# EAGLE design 74122hack (EAGLE 6.6.0)
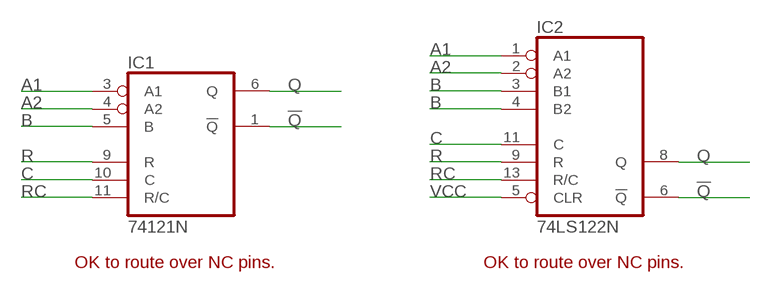
[diagram p0: schematic, sheet 1]

## Parts
IC1  74121N  [DIL14]
IC2  74LS122N  [DIL14]

## Nets
!Q: IC1.1(!Q) IC2.6(!Q)
A1: IC1.3(A1) IC2.1(A1)
A2: IC1.4(A2) IC2.2(A2)
B: IC1.5(B) IC2.3(B1) IC2.4(B2)
C: IC1.10(C) IC2.11(C)
Q: IC1.6(Q) IC2.8(Q)
R: IC1.9(R) IC2.9(R)
RC: IC1.11(R/C) IC2.13(R/C)
VCC: IC2.5(CLR)

## Notes on the sheet
- OK to route over NC pins. | OK to route over NC pins.

## Power pins joined to a net without a drawn wire
GND: IC1.7(GND) IC2.7(GND)
VCC: IC1.14(VCC) IC2.14(VCC)

## Library data of the parts
IC1 = 74xx-us:74*121: Monostable MULTIVIBRATOR, schmitt trigger inputs
IC2 = 74xx-us:74*122: Retriggerable monostable MULTIVIBRATOR

## Board
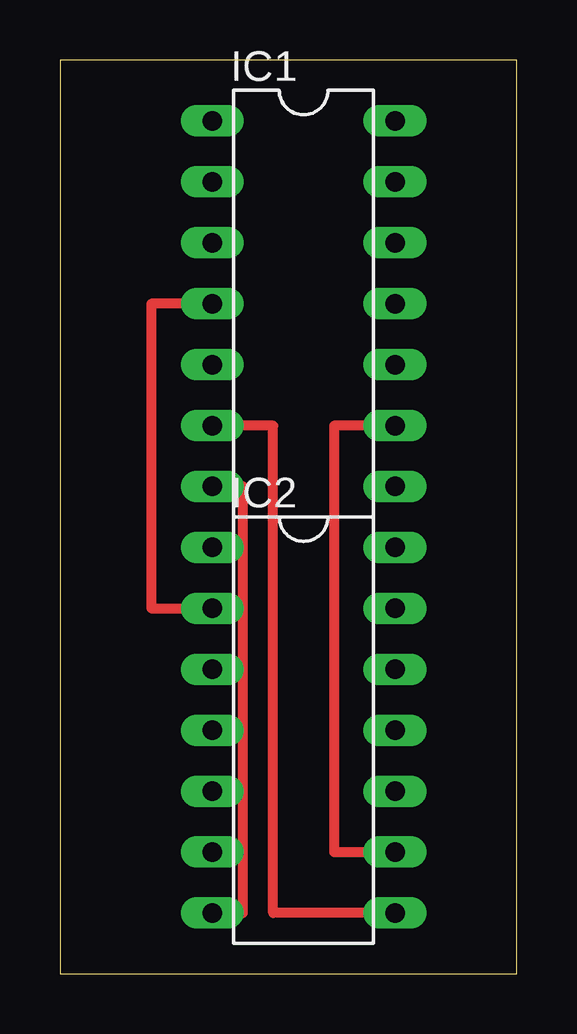
[diagram p1: board, top side]
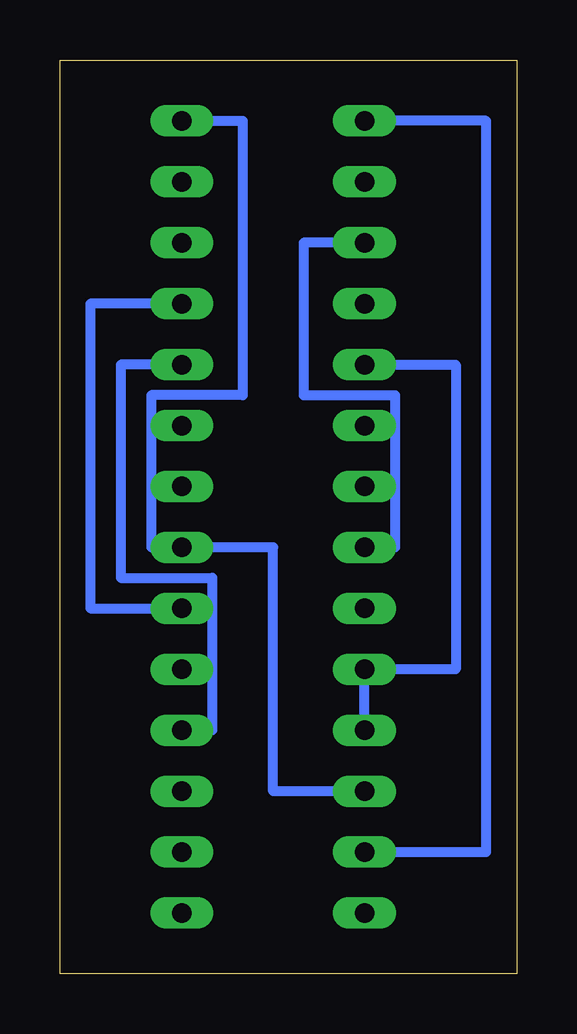
[diagram p2: board, bottom side, seen from below]

Size 19.05 x 38.1 mm. Coordinates in mm from the lower left corner, seen from the top.
Outline: 0,0 19.05,0 19.05,38.1 0,38.1 0,0
Copper layers (1+16): Top 0.035mm / dielectric 1.5mm / Bottom 0.035mm
Design rules "16mils": minimum track width 16mil, minimum drill 32mil, track to track 15mil, track to pad 10mil, pad to pad 10mil, via to via 10mil, smd to smd 10mil, copper to edge 13mil, drill to drill 10mil, minimum pad ring 10mil, minimum via ring 8mil, stop-mask expansion 0mil, vias tented up to drill 0mil, thermal gap 10mil

### Footprints (pad centres in the part's own frame; a part is rotated, then mirrored left to right if it is on the bottom)
DIL14 = drill 0.813 long: 1 -7.62,-3.81; 2 -5.08,-3.81; 3 -2.54,-3.81; 4 0,-3.81; 5 2.54,-3.81; 6 5.08,-3.81; 7 7.62,-3.81; 8 7.62,3.81; 9 5.08,3.81; 10 2.54,3.81; 11 0,3.81; 12 -2.54,3.81; 13 -5.08,3.81; 14 -7.62,3.81

### Placement (x,y rotation side)
IC1  10.16,27.94 270 top
IC2  10.16,10.16 270 top

### Tracks (layer width: path | path; a pad name or v marks a point on that pad's centre or on a via)
!Q
  Bottom 0.406: IC2.6 1.27,5.08 1.27,35.56 IC1.1
A1
  Bottom 0.406: IC1.3 8.89,30.48 8.89,24.13 5.08,24.13 5.08,17.78 IC2.1
A2
  Top 0.406: IC1.4 3.81,27.94 3.81,15.24 IC2.2
B
  Bottom 0.406: IC1.5 2.54,25.4 2.54,12.7 IC2.3 IC2.4
C
  Bottom 0.406: IC1.10 16.51,25.4 16.51,16.51 12.7,16.51 12.7,10.16 IC2.11
GND
  Top 0.406: IC1.7 7.62,20.32 7.62,2.54 IC2.7
Q
  Top 0.406: IC2.8 8.89,2.54 8.89,22.86 IC1.6
R
  Top 0.406: IC1.9 11.43,22.86 11.43,5.08 IC2.9
RC
  Bottom 0.406: IC1.11 17.78,27.94 17.78,15.24 IC2.13
VCC
  Bottom 0.406: IC2.5 10.16,7.62 10.16,17.78 IC2.14 15.24,17.78 15.24,24.13 11.43,24.13 11.43,35.56 IC1.14